# EAGLE design Center_Panel_f1 (EAGLE 9.0.0)
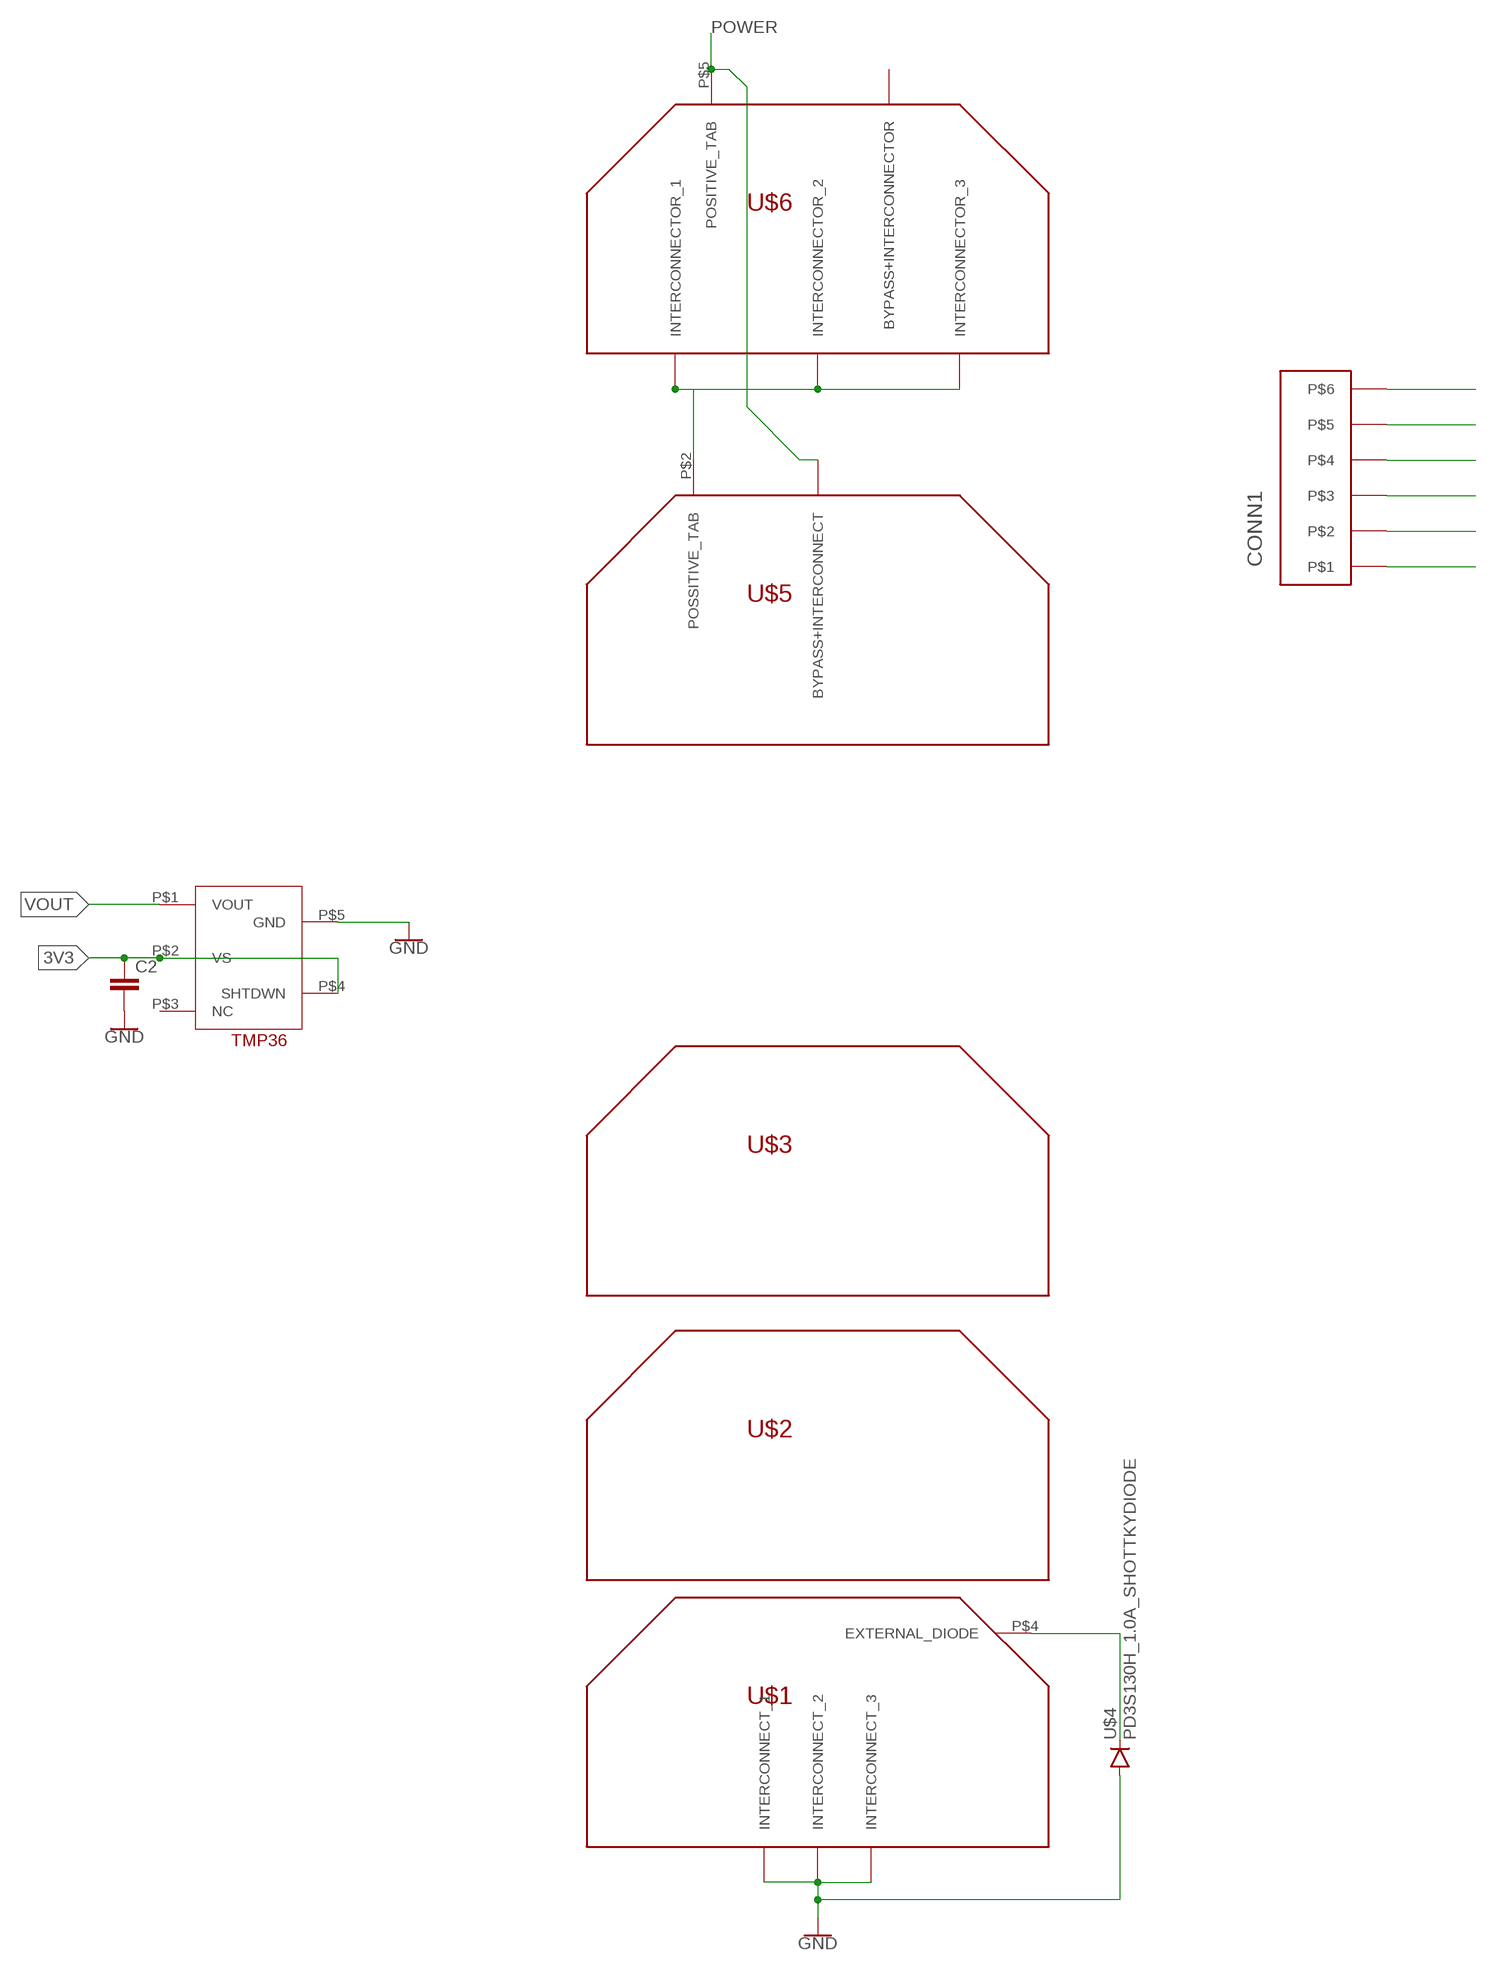
[diagram p0: schematic, sheet 1]

## Parts
C2  CAPACITOR0805  [0805]
CONN1  PICOLOCK_6  [PICOLOCK_6]
U$1  SOLAR_CELL_BOTTOM_W_DIODE  [SOLAR_CELL_BOTTOM_SHORT-PADS]
U$2  SOALAR_CELL_OUTLINE  [SOLAR_CELL_OUTLINE]
U$3  SOALAR_CELL_OUTLINE  [SOLAR_CELL_OUTLINE]
U$4  PD3S130H_1.0A_SHOTTKYDIODE  [POWERDI_323]
U$5  SOLAR_CELL_TOP  [SOLAR_CELL_TOP_SHORT-PAD]
U$6  SOLAR_CELL_STAND-ALONE  [SOLAR_CELL_STAND-ALONE]
U$7  TMP36  [SOT-23-5]

## Nets
3V3: C2.1 CONN1.P$3 U$7.P$2(VS) U$7.P$4(SHTDWN)
GND: CONN1.P$2 CONN1.P$5 U$1.P$1(INTERCONNECT_1) U$1.P$2(INTERCONNECT_2) U$1.P$3(INTERCONNECT_3) U$4.P$2(A) U$7.P$5(GND)
N$7: U$5.P$2(POSSITIVE_TAB) U$6.P$1(INTERCONNECTOR_1) U$6.P$2(INTERCONNECTOR_2) U$6.P$3(INTERCONNECTOR_3)
N$8: U$1.P$4(EXTERNAL_DIODE) U$4.P$1(C)
POWER: CONN1.P$1 CONN1.P$6 U$5.P$1(BYPASS+INTERCONNECT) U$6.P$5(POSITIVE_TAB)
VOUT: CONN1.P$4 U$7.P$1(VOUT)
Unconnected: C2.2 U$6.P$4(BYPASS+INTERCONNECTOR) U$7.P$3(NC)

## Library data of the parts
C2 = DubSat1 Components:CAPACITOR: Capacitor Standard 0603 ceramic capacitor, and 0.1" leaded capacitor.
CONN1 = DubSat1 Components:PICOLOCK_6
U$1 = DubSat1 Components:SOLAR_CELL_BOTTOM_W_DIODE: Azurspace Solar cell: http://www.azurspace.com/images/products/0003401-01-01_DB_3G30A.pdf Contains an outline of the cell with pads on the bottom for the main interconnectors. To be used as the bottom cell in a string of cells.
U$2 U$3 = DubSat1 Components:SOALAR_CELL_OUTLINE: Azurspace Solar Cell: http://www.azurspace.com/images/products/0003401-01-01_DB_3G30A.pdf Contains an outline of the solar cell without any pads because the interconnectors will be attached externaly and not on the board. This footprint is to be used as the center cells in a string of cells.
U$4 = DubSat1 Components:PD3S130H_1.0A_SHOTTKYDIODE
U$5 = DubSat1 Components:SOLAR_CELL_TOP: Azurspace solar cell: http://www.azurspace.com/images/products/0003401-01-01_DB_3G30A.pdf With outline of full cell + pad for top side introconnector and integrated bypass diode. To be used as the top cell in a string of cells.
U$6 = DubSat1 Components:SOLAR_CELL_STAND-ALONE
U$7 = DubSat1 Components:TMP36

## Board
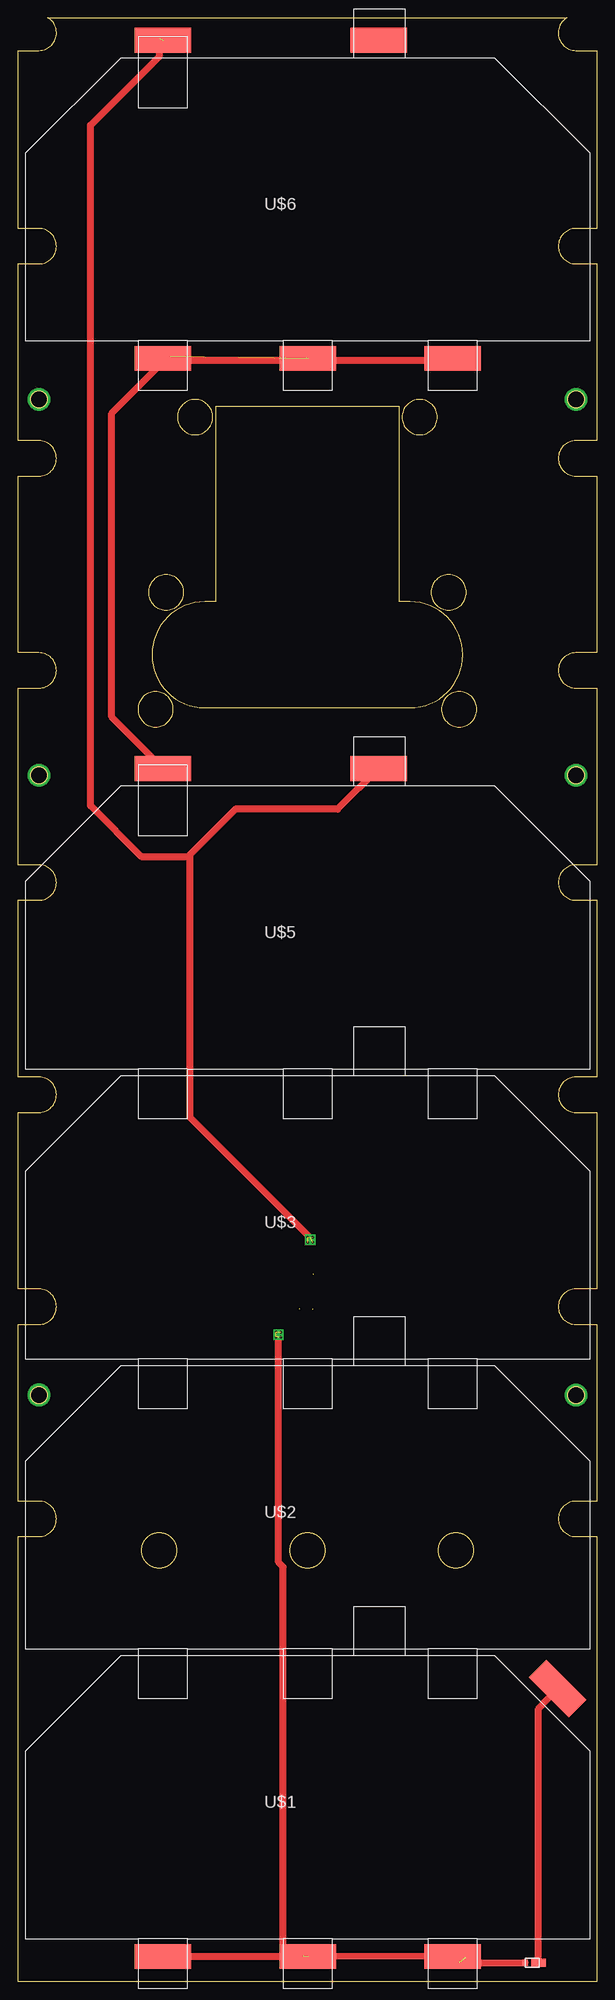
[diagram p1: board, top side]
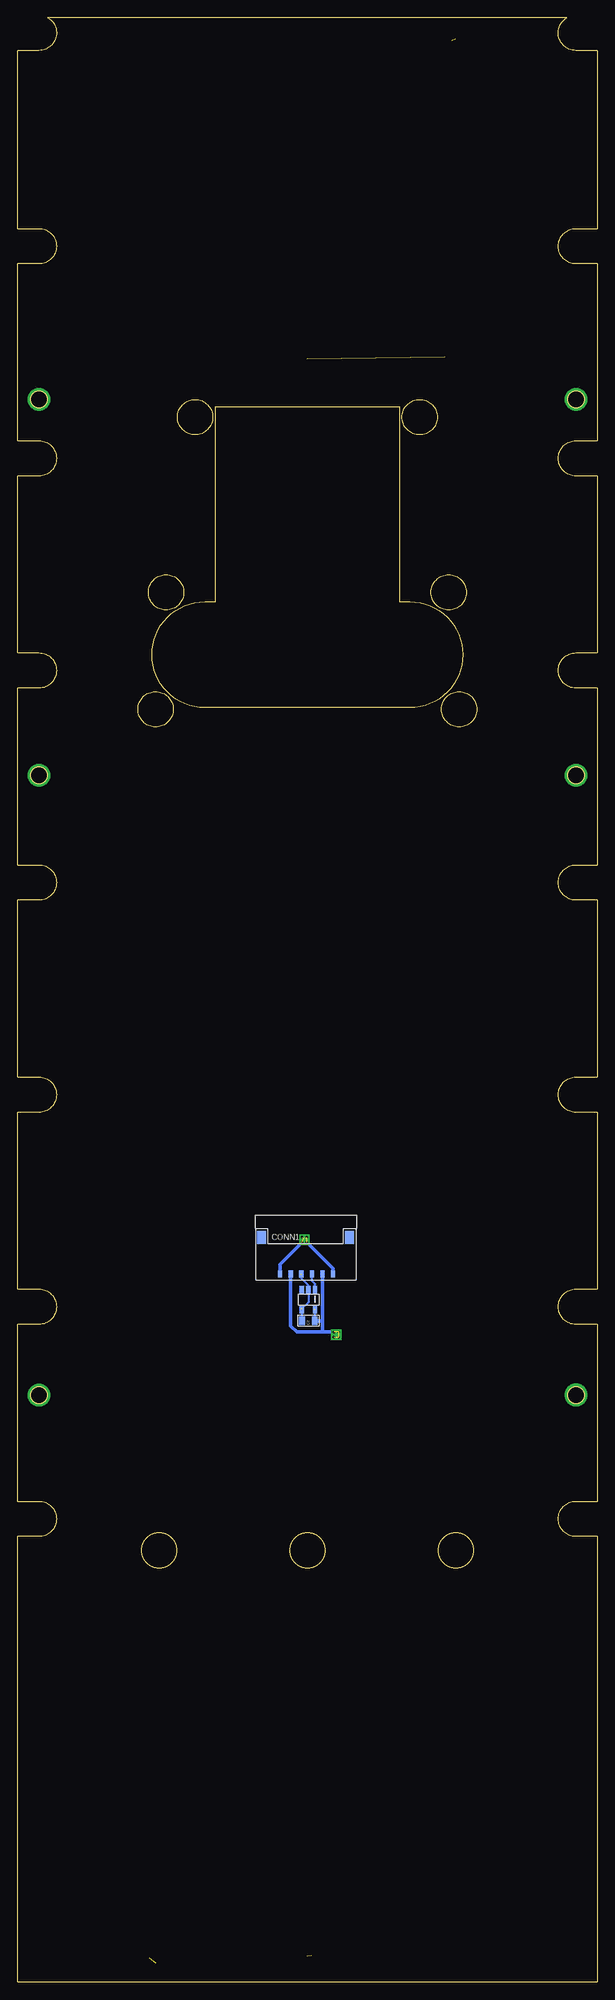
[diagram p2: board, bottom side, seen from below]

Size 82 x 277.8 mm. Coordinates in mm from the lower left corner, seen from the top.
Outline: 28,195.19 28,195.19
Outline: 28,195.19 26.5,195.19
Outline: 26.5,195.19 arc180 26.5,195.19
Outline: 28,195.19 arc180 28,195.19
Outline: 26.5,180.19 55.5,180.19
Outline: 55.5,180.19 arc180 55.5,180.19
Outline: 26.5,180.19 arc180 26.5,180.19
Outline: 55.5,195.19 54,195.19
Outline: 54,195.19 54,195.19
Outline: 54,195.19 arc180 54,195.19
Outline: 55.5,195.19 arc180 55.5,195.19
Outline: 54,195.19 54,222.75
Outline: 54,222.75 54,222.75
Outline: 54,222.75 arc180 54,222.75
Outline: 54,195.19 arc180 54,195.19
Outline: 54,222.75 28,222.75
Outline: 28,222.75 28,222.75
Outline: 28,222.75 arc180 28,222.75
Outline: 54,222.75 arc180 54,222.75
Outline: 28,222.75 28,195.19
Outline: 28,195.19 arc180 28,195.19
Outline: 28,222.75 arc180 28,222.75
Outline: 26.5,195.19 arc180 26.5,180.19
Outline: 26.5,195.19 arc180 26.5,195.19
Outline: 26.5,180.19 arc180 26.5,180.19
Outline: 55.5,180.19 arc180 55.5,195.19
Outline: 55.5,180.19 arc180 55.5,180.19
Outline: 55.5,195.19 arc180 55.5,195.19
Outline: 79,273.15 82,273.15 82,247.98 79,247.98 arc180 79,242.98 82,242.98 82,217.98 79,217.98 arc180 79,212.98 82,212.98 82,187.98 79,187.98 arc180 79,182.98 82,182.98 82,157.98 79,157.98 arc180 79,152.98 82,152.98 82,127.98 79,127.98 arc180 79,122.98 82,122.98 82,97.98 79,97.98 arc180 79,92.98 82,92.98 82,67.98 79,67.98 arc180 79,62.98 82,62.98 82,0 0,0 0,62.98 3,62.98 arc180 3,67.98 0,67.98 0,92.98 3,92.98 arc180 3,97.98 0,97.98 0,122.98 3,122.98 arc180 3,127.98 0,127.98 0,152.98 3,152.98 arc180 3,157.98 0,157.98 0,182.98 3,182.98 arc180 3,187.98 0,187.98 0,212.98 3,212.98 arc180 3,217.98 0,217.98 0,242.98 3,242.98 arc180 3,247.98 0,247.98 0,273.15 3,273.15 arc149 4.28,277.8 77.72,277.8 arc149 79,273.15
Outline: 19.52,177.49 arc180 19.52,182.49 arc180 19.52,177.49
Outline: 21,194.02 arc180 21,199.02 arc180 21,194.02
Outline: 25.11,218.8 arc180 25.11,223.8 arc180 25.11,218.8
Outline: 62.48,177.49 arc180 62.48,182.49 arc180 62.48,177.49
Outline: 61,194.02 arc180 61,199.02 arc180 61,194.02
Outline: 56.89,218.8 arc180 56.89,223.8 arc180 56.89,218.8
Outline: circle at 62,61 radius 2.5
Outline: circle at 41,61 radius 2.5
Outline: circle at 20,61 radius 2.5
Outline: circle at 3,223.8 radius 1.19
Outline: circle at 3,83 radius 1.19
Outline: circle at 79,223.8 radius 1.19
Outline: circle at 79,170.65 radius 1.19
Outline: circle at 3,170.65 radius 1.19
Outline: circle at 79,83 radius 1.19
Copper layers (1*16): Top 0.07111875mm / dielectric 2mm / Bottom 0.07111875mm
Design rules "Center panel V1.2": minimum track width 10mil, minimum drill 24mil, track to track 0.205mm, track to pad 0.205mm, pad to pad 0.205mm, via to via 0.205mm, smd to smd 8mil, copper to edge 40mil, drill to drill 8mil, minimum pad ring 10mil, minimum via ring 8mil, stop-mask expansion 4mil, vias tented up to drill 0mil, thermal gap 10mil

### Footprints (pad centres in the part's own frame; a part is rotated, then mirrored left to right if it is on the bottom)
0805 = smd 0.8 x 1.2: 1 -0.9,0; 2 0.9,0
PICOLOCK_6 = smd 1.25 x 1.8: MNT@1 -2.605,5.2; MNT@2 9.805,5.2 | smd 0.6 x 1: P$1 0,0; P$2 1.5,0; P$3 3,0; P$4 4.5,0; P$5 6,0; P$6 7.5,0
SOLAR_CELL_BOTTOM_SHORT-PADS = smd 8 x 3.5: P$1 19.5,-2.5; P$2 40,-2.5; P$3 60.5,-2.5 | smd 8 x 3.5 rotated 315: P$4 75.306,35.346
POWERDI_323 = smd 2 x 1.1: P$1 -1.25,0 | smd 0.8 x 0.8: P$2 0.65,0
SOLAR_CELL_TOP_SHORT-PAD = smd 8 x 3.5: P$1 50,42.5; P$2 19.5,42.5
SOLAR_CELL_STAND-ALONE = smd 8 x 3.5: P$1 19.5,-2.5; P$2 40,-2.5; P$3 60.5,-2.5; P$4 50,42.5; P$5 19.5,42.5
SOT-23-5 = smd 0.6 x 1.2: P$1 -0.95,-1.35; P$2 0,-1.35; P$3 0.95,-1.35; P$4 0.95,1.35; P$5 -0.95,1.35

### Placement (x,y rotation side)
C2  40.86,93.5 0 bottom
CONN1  44.86,100.1 0 bottom
U$1  1.06,6.1 0 top
U$2  1.06,47.1 0 top
U$3  1.06,88.1 0 top
U$4  72.46,2.7 180 top
U$5  1.06,129.1 0 top
U$6  1.06,232.1 0 top
U$7  40.86,96.5 180 bottom

### Tracks (layer width: path | path; a pad name or v marks a point on that pad's centre or on a via)
3V3  (2 unrouted)
  Bottom 0.305: C2.1 41.76,95.1 | 41.89,100.07 41.89,99.55 40.86,98.52 U$7.P$2 40.86,96.1 U$7.P$4
GND  (via drill 0.35)  (7 unrouted)
  Top 0.305: U$1.P$3 62.46,2.7
  Top 1.016: U$1.P$1 40.31,3.6 40.4,3.69 U$1.P$3 | 62.76,4 63.36,3.4 | U$1.P$2 38.46,3.6 37.56,2.7 37.56,58.68 36.93,59.31 36.93,91.13 36.86,91.2 | 62.46,2.7 U$4.P$2
  Bottom 0.305: 39.96,95.1 39.96,93.5
  Bottom 0.508: v37.26,91.9 38.86,91.9 | 38.86,91.9 42.46,91.9 43.36,92.8 CONN1.P$2 | CONN1.P$5 38.86,93.5 | 38.86,93.5 38.86,91.9 | 39.96,93.5 38.86,93.5
  other vias: 36.56,91.9 36.56,91.2 37.26,91.2
N$1  (via drill 2.18)
  other vias: 79,223.8
N$2  (via drill 2.2)
  other vias: 3,83
N$3  (via drill 2.18)
  other vias: 2.99,223.8
N$4  (via drill 2.18)
  other vias: 3,170.65
N$5  (via drill 2.18)
  other vias: 79,170.65
N$6  (via drill 2.18)
  other vias: 79,83
N$7  (1 unrouted)
  Top 1.016: U$5.P$2 13.31,178.9 13.31,221.85 20.81,229.35 | 20.81,229.35 21.31,229.85 21.56,229.85 21.31,229.6 U$6.P$1 20.81,229.35 | 20.81,228.85 20.81,229.35 | 20.81,229.35 61.31,229.35 U$6.P$3
N$8
  Top 1.016: U$4.P$1 73.71,38.61 U$1.P$4
POWER  (via drill 0.35)  (5 unrouted)
  Top 1.016: U$5.P$1 45.26,165.85 30.81,165.85 24.36,159.4 | 24.36,159.4 24.06,159.1 17.56,159.1 10.31,166.35 10.31,262.6 20.06,272.35 20.06,274.85 20.56,275.35 | 24.36,159.4 24.36,122.3 41.46,105.2
  Bottom 0.508: v41.06,104.6 37.36,100.9 CONN1.P$6 | v41.76,104.6 44.86,101.5 CONN1.P$1
  other vias: 41.06,105.3 41.76,105.3
VOUT
  Bottom 0.305: U$7.P$1 39.91,98.71 40.36,99.16 CONN1.P$4